# Altium schematic sheet gpio.SchDoc
size A4
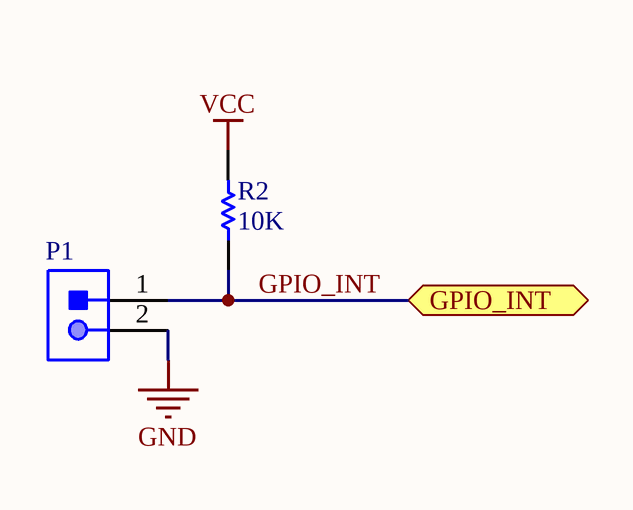
[diagram p0: gpio.SchDoc]

## Parts
P1  61300211021  [61300211021]  (value not drawn)
R2  10K  [RESC1608X55X30LL15T15]

## Ports
GPIO_INT (bidir)

## Nets
GND: P1.2
VCC: R2.2
GPIO_INT: P1.1 R2.1 ; port GPIO_INT

## Library data of the parts
P1 = CMP-1502-01059-1: THT Angled Pin Header WR-PHD, Pitch 2.54 mm, Single Row, 2 pins; Manufacturer: Wurth Elektronik; Withstanding Voltage: 500VAC; Gender: Male; Pitch: 2.54mm; Pin Number: 2; Rated Current: 3A; Contact Resistance: 20mOhm; Working Voltage: 250VAC; Packaging: Bag; Mounting Technology: THT; Part Number: 61300211021; Manufacturer URL: http://www.we-online.de; Operating Temperature: -40to105degC; Row Number: Single; Publisher: WurthElektronik; Orientation: Angled; Datasheet URL: https://katalog.we-online.de/em/datasheet/6130xx11021.pdf; Package Reference: 61300211021
R2 = CMP-2000-00181-1: Part Number: ERJ-3EKF1002V; Manufacturer: Panasonic